# Altium project Projet_ESP32_Nassima_Alexis_Thomas.PrjPcb
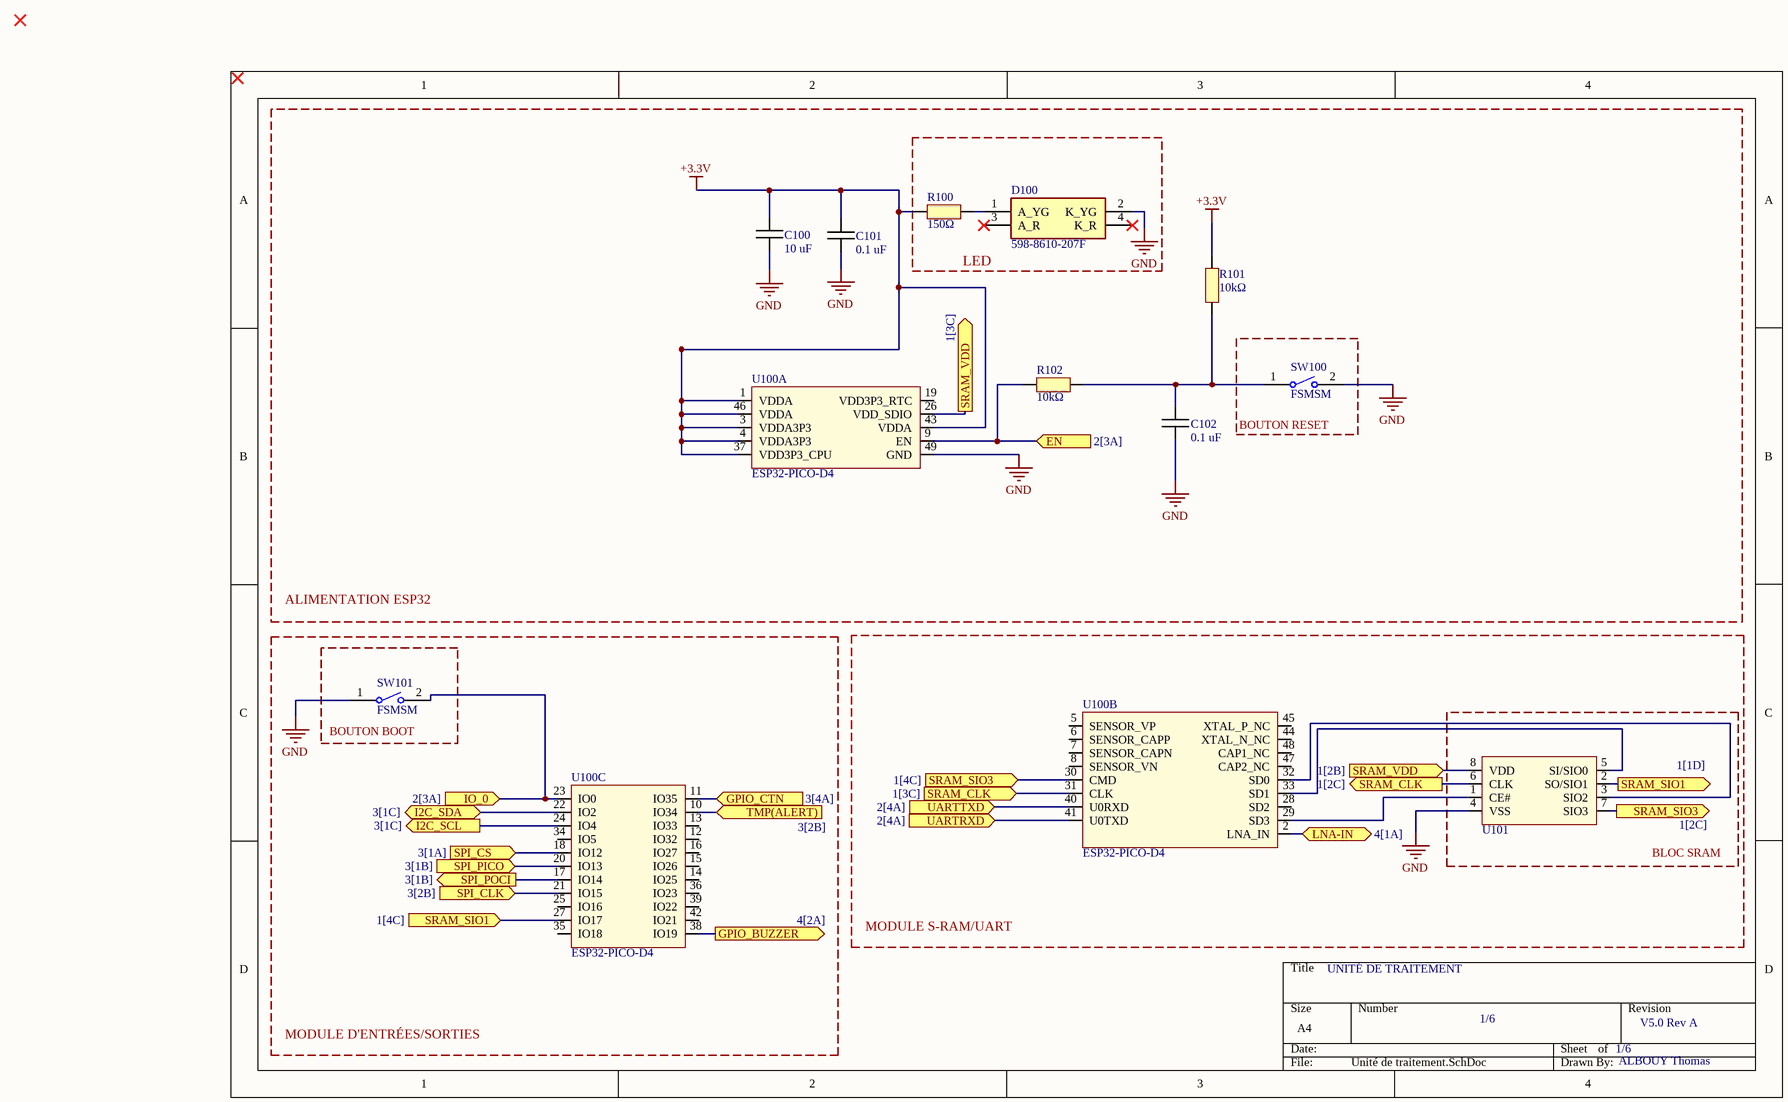
[diagram p0: Unité de traitement.SchDoc]
6 sheets, 72 parts. Net scope: flat (ports and power ports of the same name join across sheets).
Board file: PCB_ESP32_GROUPE5.PcbDoc
Sheets:
  Unité de traitement.SchDoc
  Alimentation.SchDoc
  Mesures.SchDoc
  Accesoire antenne et buzzer.SchDoc
  Connecteurs.SchDoc
  Régulateur USB HT BT.SchDoc

## Sheet Unité de traitement.SchDoc: UNITÉ DE TRAITEMENT
size A4; DrawnBy: ALBOUY Thomas; DocumentNumber: 1/6; Revision: V5.0 Rev A; SheetNumber: 1; SheetTotal: 6

### Parts
C100  10 uF  [CAPC1005X06N]
C101  0.1 uF  [CAPC1005X06N]
C102  0.1 uF  [CAPC1005X06N]
D100  598-8610-207F  [5988610207F]
R100  150Ω  [RESC1005X06N]
R101  10kΩ  [RESC1005X06N]
R102  10kΩ  [RESC1005X06N]
SW100  FSMSM  [TECO-FSMSM-2_V]
SW101  FSMSM  [TECO-FSMSM-2_V]
U100  ESP32-PICO-D4  [PQFN50P700X700X104_HS-49N]  (parts A,B,C of 3)
U101  IS66WVS1M8BLL-104NLI  [SOIC127P600X175-8N]  (value not drawn)

### Blocks framed on the sheet
ALIMENTATION ESP32: C100-C102 R101 R102 U100
LED: D100 R100
BOUTON RESET: SW100
MODULE D'ENTRÉES/SORTIES: U100
MODULE S-RAM/UART: U100
BOUTON BOOT: SW101
BLOC SRAM: U101

### Ports
EN (in, see 2[3A]), GPIO_BUZZER (out, see 4[2A]), GPIO_CTN (in, see 3[4A]), I2C_SCL (out, see 3[1C]), I2C_SDA (bidir, see 3[1C]), IO_0 (in, see 2[3A]), LNA-IN (bidir, see 4[1A]), SPI_CLK (in, see 3[2B]), SPI_CS (in, see 3[1A]), SPI_PICO (in, see 3[1B]), SPI_POCI (out, see 3[1B]), SRAM_CLK (in, see 1[3C]), SRAM_CLK (out, see 1[2C]), SRAM_SIO1 (in, see 1[4C]), SRAM_SIO1 (out, see 1[1D]), SRAM_SIO3 (in, see 1[4C]), SRAM_SIO3 (out, see 1[2C]), SRAM_VDD (in, see 1[2B]), SRAM_VDD (out, see 1[3C]), TMP(ALERT) (in, see 3[2B]), UARTRXD (in, see 2[4A]), UARTTXD (in, see 2[4A])

### Nets
+3.3V: C100.1 C101.1 R100.1 R101.2 U100.1(VDDA) U100.3(VDDA3P3) U100.4(VDDA3P3) U100.37(VDD3P3_CPU) U100.43(VDDA) U100.46(VDDA)
GND: C100.2 C101.2 C102.2 D100.2(K_YG) SW100.2 SW101.1 U100.49(GND) U101.4(VSS)
NetB1_2: U100.11(IO35) ; port GPIO_CTN
NetB*1_1: U100.18(IO12) ; port SPI_CS
NetB*1_3: U100.17(IO14) ; port SPI_POCI
NetB*1_4: U100.21(IO15) ; port SPI_CLK
NetB*1_5: U100.10(IO34) ; port TMP(ALERT)
NetB*2_4: U100.22(IO2) ; port I2C_SDA
NetB*2_5: U100.24(IO4) ; port I2C_SCL
NetC8_1: U100.2(LNA_IN) ; port LNA-IN
NetC102_1: C102.1 R101.1 R102.2 SW100.1
NetD100_1: D100.1(A_YG) R100.2
NetJ3_3: U100.20(IO13) ; port SPI_PICO
NetR12_1: U100.38(IO19) ; port GPIO_BUZZER
NetR102_1: R102.1 U100.9(EN) ; port EN
NetSW101_2: SW101.2 U100.23(IO0) ; port IO_0
NetU100_26: U100.26(VDD_SDIO) U101.8(VDD) ; port SRAM_VDD
NetU100_27: U100.27(IO17) U101.2(SO/SIO1) ; port SRAM_SIO1
NetU100_29: U100.29(SD3) U101.1(CE#)
NetU100_30: U100.30(CMD) U101.7(SIO3) ; port SRAM_SIO3
NetU100_31: U100.31(CLK) U101.6(CLK) ; port SRAM_CLK
NetU100_32: U100.32(SD0) U101.3(SIO2)
NetU100_33: U100.33(SD1) U101.5(SI/SIO0)
NetU100_40: U100.40(U0RXD) ; port UARTTXD
NetU100_41: U100.41(U0TXD) ; port UARTRXD

Not connected (* = marked no-connect by the designer): D100 3(A_R)* 4(K_R)*; U100 5(SENSOR_VP) 6(SENSOR_CAPP) 7(SENSOR_CAPN) 8(SENSOR_VN) 12(IO32) 13(IO33) 14(IO25) 15(IO26) 16(IO27) 19(VDD3P3_RTC) 25(IO16) 28(SD2) 34(IO5) 35(IO18) 36(IO23) 39(IO22) 42(IO21) 44(XTAL_N_NC) 45(XTAL_P_NC) 47(CAP2_NC) 48(CAP1_NC)

### Library data of the parts
C100-C102 = Capacitor
D100 = 598-8610-207F: Standard LEDs - SMD Red/Green WC 80/50mcd 645/570nm; Manufacturer_Name: Dialight; Geometry.Height: 0.8mm; Manufacturer_Part_Number: 598-8610-207F; Mouser Part Number: 645-598-8610-207F; Mouser Price/Stock: https://www.mouser.co.uk/ProductDetail/Dialight/598-8610-207F?qs=7JStj%2FjQ2SFuCjosqwklHQ%3D%3D; Arrow Part Number: 598-8610-207F; Arrow Price/Stock: https://www.arrow.com/en/products/598-8610-207f/dialight?region=nac; Datasheet Link: https://media.digikey.com/pdf/Data%20Sheets/Dialight%20PDFs/598%20Series%201210%20Pkg%20Bi-Color.pdf
R100-R102 = Resistor
SW100 SW101 = CMP-2000-07511-1: FSMSM Push Button Switch, 50 mA, -35 to 85 degC, 2-Pin SMD, RoHS, Bulk; Manufacturer: TE Connectivity; Actuator Length: 1.07mm; Electrical Life: 20000Cycles; Actuator Material: Polyamide; Current Rating: 50mA; Illumination Type: Illuminated; Voltage Rating (DC): 24V; Contact Resistance: 100mOhm; Case\/Package: SMD/SMT; Operating Force: 180gf; Switch Travel: 0.25mm; Max Voltage Rating (DC): 12V; Throw Configuration: SPST; Packaging: LoosePiece; Max Operating Temperature: 85degC; ELV: Compliant; Package Description: 2-Pin Surface Mount Device, Body 6 x 3.5 mm, Pitch 9.19 mm; RoHSCompliant: true; Manufacturer URL: http://www.te.com/; Contact Plating: Silver; Contact Material: Brass; Mounting Technology: SurfaceMount; Contact Current Rating: 50mA; Datasheet Version: Rev. C2, 08/2014; Datasheet URL: http://www.te.com/commerce/DocumentDelivery/DDEController?Action=showdoc&DocId=Customer+Drawing%7F1437566-3%7FC2%7Fpdf%7FEnglish%7FENG_CD_1437566-3_C2_1437566_3_1_c.dwg.pdf%7F1437566-3; Mechanical Life: 20000Cycles; Package Reference: FSMSM; REACH SVHC: Unknown; Orientation: Straight; Min Operating Temperature: -35degC; Lead Free: LeadFree; Termination: GullWing; Package Quantity: 1000; Mount: SurfaceMount
U100 = ESP32: Système RF sur puce - SoC SIP module ESP32 with 4MByte Flash, Dual Core MCU, Wi-Fi & Bluetooth Combo, LGA48-pin, 7*7mm; Manufacturer 1: Espressif Systems; Supplier 1: Digi-Key; Supplier Part Number 1: 1904-1029-1-ND; Manufacturer Part Number 1: ESP32-PICO-D4
U101 = SRAM: SRAM 8Mb, SerialRAM, 2.7V-3.6V, 104MHz, 8 pin SOIC 150 mil, RoHS; Manufacturer 1: ISSI; Supplier 1: Digi-Key; Supplier Part Number 1: 706-IS66WVS1M8BLL-104NLI-ND; Manufactuer Part Number 1: IS66WVS1M8BLL-104NLI

## Sheet Alimentation.SchDoc
size A4; SheetNumber: 4; SheetTotal: 7
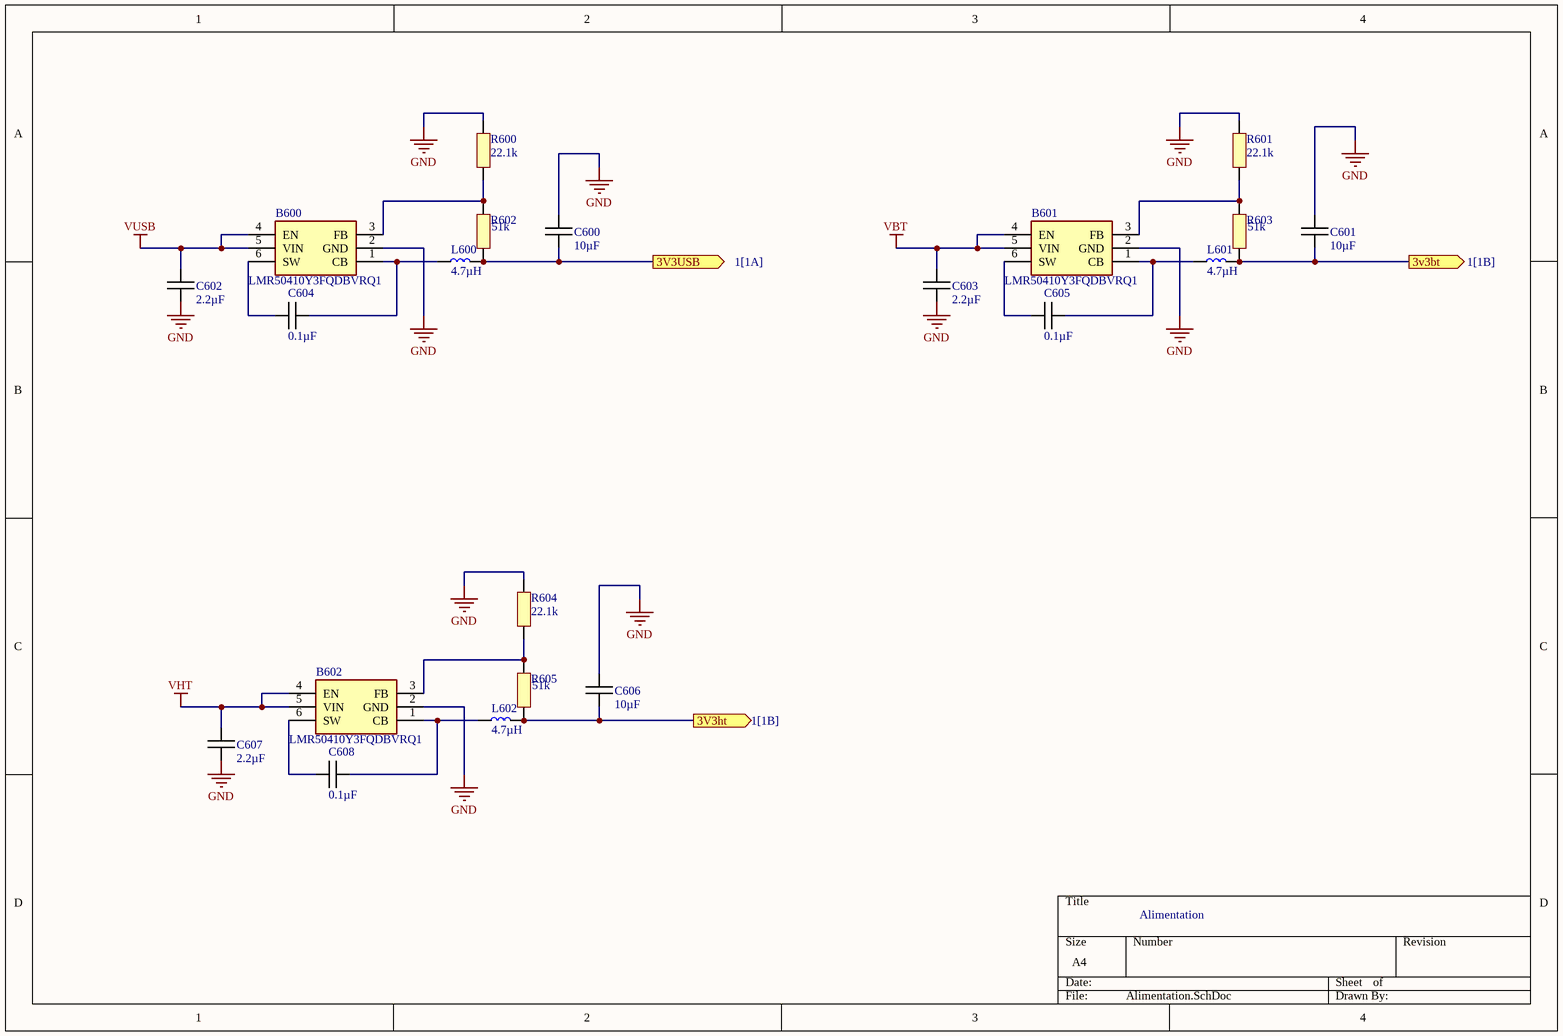
[diagram p1: Alimentation.SchDoc]

### Parts
B600  LMR50410Y3FQDBVRQ1  [SOT95P280X145-6N]
B601  LMR50410Y3FQDBVRQ1  [SOT95P280X145-6N]
B602  LMR50410Y3FQDBVRQ1  [SOT95P280X145-6N]
C600  10µF  [CAPC1005X06N]
C601  10µF  [CAPC1005X06N]
C602  2.2µF  [CAPC1005X06N]
C603  2.2µF  [CAPC1005X06N]
C604  0.1µF  [CAPC1005X06N]
C605  0.1µF  [CAPC1005X06N]
C606  10µF  [CAPC1005X06N]
C607  2.2µF  [CAPC1005X06N]
C608  0.1µF  [CAPC1005X06N]
L600  4.7µH  [LQPC1005X06N]
L601  4.7µH  [LQPC1005X06N]
L602  4.7µH  [LQPC1005X06N]
R600  22.1k  [RESC1005X06N]
R601  22.1k  [RESC1005X06N]
R602  51k  [RESC1005X06N]
R603  51k  [RESC1005X06N]
R604  22.1k  [RESC1005X06N]
R605  51k  [RESC1005X06N]

### Ports
3v3bt (out, see 1[1B]), 3V3ht (out, see 1[1B]), 3V3USB (out, see 1[1A])

### Nets
GND: B600.2(GND) B601.2(GND) B602.2(GND) C600.1 C601.1 C602.2 C603.2 C606.1 C607.2 R600.2 R601.2 R604.2
VBT: B601.4(EN) B601.5(VIN) C603.1
VHT: B602.4(EN) B602.5(VIN) C607.1
VUSB: B600.4(EN) B600.5(VIN) C602.1
NetB600_1: B600.1(CB) C604.1 L600.1
NetB600_3: B600.3(FB) R600.1 R602.2
NetB600_6: B600.6(SW) C604.2
NetB601_1: B601.1(CB) C605.1 L601.1
NetB601_3: B601.3(FB) R601.1 R603.2
NetB601_6: B601.6(SW) C605.2
NetB602_1: B602.1(CB) C608.1 L602.1
NetB602_3: B602.3(FB) R604.1 R605.2
NetB602_6: B602.6(SW) C608.2
NetC600_2: C600.2 L600.2 R602.1 ; port 3V3USB
NetC601_2: C601.2 L601.2 R603.1 ; port 3v3bt
NetC606_2: C606.2 L602.2 R605.1 ; port 3V3ht

### Notes on the sheet
- Alimentation

### Library data of the parts
B600-B602 = LMR50410Y3FQDBVRQ1: Régulateurs de tension de commutation Automotive qualified SIMPLE SWITCHER 4-V to 36-V, 1-A synchronous step-down converter 6-SOT-23 -40 to 150; Manufacturer_Name: Texas Instruments; Manufacturer_Part_Number: LMR50410Y3FQDBVRQ1; Mouser Part Number: 595-R50410Y3FQDBVRQ1
C600-C608 = Capacitor
L600-L602 = Bobine
R600-R605 = Resistor

## Sheet Mesures.SchDoc: MESURES CAPTEUR TEMPÉRATURE
size A4; DrawnBy: ALBOUY Thomas; DocumentNumber: 3/6; Revision: V5.0 REV.A; SheetNumber: 3; SheetTotal: 6
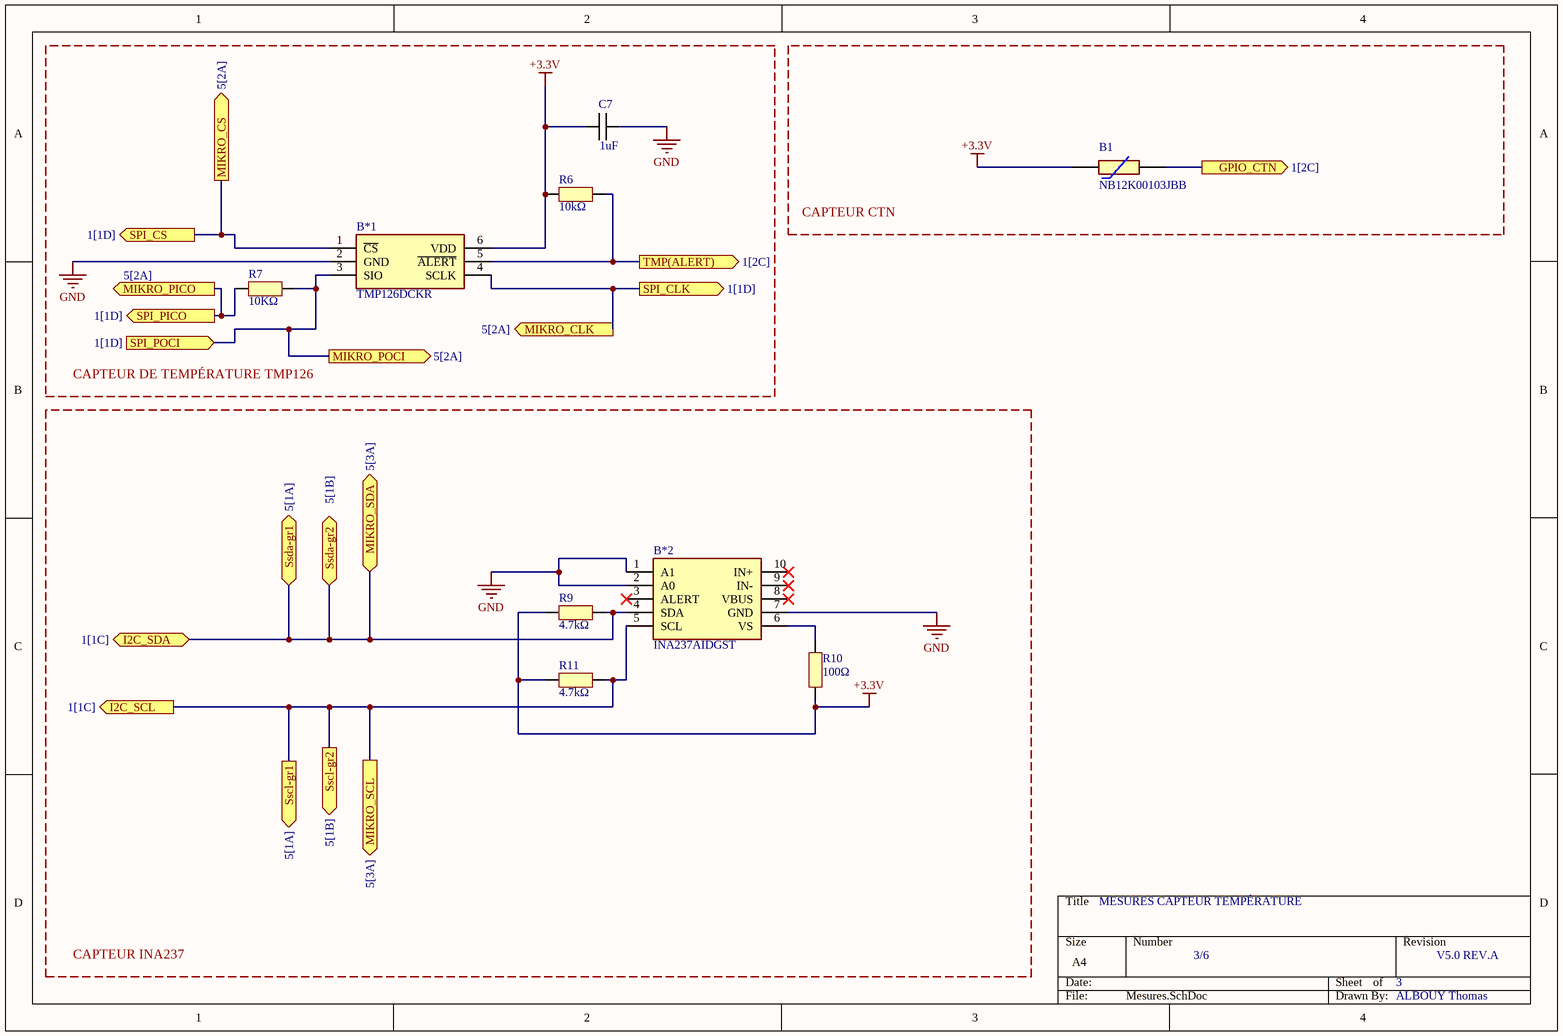
[diagram p2: Mesures.SchDoc]

### Parts
B1  NB12K00103JBB  [RESC2212X50N]
B*1  TMP126DCKR  [SOT65P210X110-6N]
B*2  INA237AIDGST  [SOP50P490X110-10N]
C7  1uF  [CAPC1005X06N]
R6  10kΩ  [RESC1005X06N]
R7  10KΩ  [RESC1005X06N]
R9  4.7kΩ  [RESC1005X06N]
R10  100Ω  [RESC1005X06N]
R11  4.7kΩ  [RESC1005X06N]

### Blocks framed on the sheet
CAPTEUR DE TEMPÉRATURE TMP126: B*1 C7 R6 R7
CAPTEUR CTN: B1
CAPTEUR INA237: B*2 R9-R11

### Ports
GPIO_CTN (out, see 1[2C]), I2C_SCL (out, see 1[1C]), I2C_SDA (bidir, see 1[1C]), MIKRO_CLK (out, see 5[2A]), MIKRO_CS (out, see 5[2A]), MIKRO_PICO (out, see 5[2A]), MIKRO_POCI (out, see 5[2A]), MIKRO_SCL (out, see 5[3A]), MIKRO_SDA (bidir, see 5[3A]), SPI_CLK (out, see 1[1D]), SPI_CS (out, see 1[1D]), SPI_PICO (out, see 1[1D]), SPI_POCI (in, see 1[1D]), Sscl-gr1 (out, see 5[1A]), Sscl-gr2 (out, see 5[1B]), Ssda-gr1 (bidir, see 5[1A]), Ssda-gr2 (bidir, see 5[1B]), TMP(ALERT) (out, see 1[2C])

### Nets
+3.3V: B1.1 B*1.6(VDD) C7.1 R6.1 R9.1 R10.1 R11.1
GND: B*1.2(GND) B*2.1(A1) B*2.2(A0) B*2.7(GND) C7.2
NetB1_2: B1.2 ; port GPIO_CTN
NetB*1_1: B*1.1(~{CS}) ; port SPI_CS, port MIKRO_CS
NetB*1_3: B*1.3(SIO) R7.2 ; port SPI_POCI, port MIKRO_POCI
NetB*1_4: B*1.4(SCLK) ; port SPI_CLK, port MIKRO_CLK
NetB*1_5: B*1.5(~{ALERT}) R6.2 ; port TMP(ALERT)
NetB*2_4: B*2.4(SDA) R9.2 ; port I2C_SDA, port Ssda-gr1, port Ssda-gr2, port MIKRO_SDA
NetB*2_5: B*2.5(SCL) R11.2 ; port I2C_SCL, port Sscl-gr1, port Sscl-gr2, port MIKRO_SCL
NetB*2_6: B*2.6(VS) R10.2
NetJ3_3: R7.1 ; port SPI_PICO, port MIKRO_PICO

Not connected (* = marked no-connect by the designer): B*2 3(ALERT)* 8(VBUS)* 9(IN-)* 10(IN+)*

### Notes on the sheet
- 3

### Library data of the parts
B1 = NB12K00103JBB: NTC SMD Thermistor, NB12K, 10K, 5% AVX 10k 0805 Protection NTC Thermistor, 5s, 2 x 1.25 x 1.3mm; Manufacturer_Name: Kyocera AVX; Geometry.Height: 0.5mm; Manufacturer_Part_Number: NB12K00103JBB; Mouser Part Number: 581-NB12K00103JBB; Mouser Price/Stock: https://www.mouser.co.uk/ProductDetail/AVX/NB12K00103JBB/?qs=4%252B6%252BTdINQeDPvI%252BQUQjJ3Q%3D%3D; Arrow Part Number: NB12K00103JBB; Arrow Price/Stock: https://www.arrow.com/en/products/nb12k00103jbb/avx; Datasheet Link: https://datasheet.datasheetarchive.com/originals/distributors/Datasheets-DGA6/551314.pdf
B*1 = TMP126DCKR: Board Mount Temperature Sensors +/-0.25 C SPI temperature sensor with 175 C operation, CRC and slew-rate alert; Manufacturer_Name: Texas Instruments; Manufacturer_Part_Number: TMP126DCKR; Mouser Part Number: 595-TMP126DCKR
B*2 = INA237AIDGST: Current Sense Amplifiers 85-V, 16-bit, I2C output current/voltage/power monitor with alert 10-VSSOP -40 to 125; Manufacturer_Name: Texas Instruments; Manufacturer_Part_Number: INA237AIDGST; Mouser Part Number: 595-INA237AIDGST
C7 = Capacitor
R6 R7 R9-R11 = Resistor

## Sheet Accesoire antenne et buzzer.SchDoc: ANTENNE BLUETOOTH/BUZZER
size A4; DrawnBy: TORIBIO Alexis; Address4: 4; DocumentNumber: 4/6; Revision: V5.0 REV.A; SheetNumber: 4; SheetTotal: 6
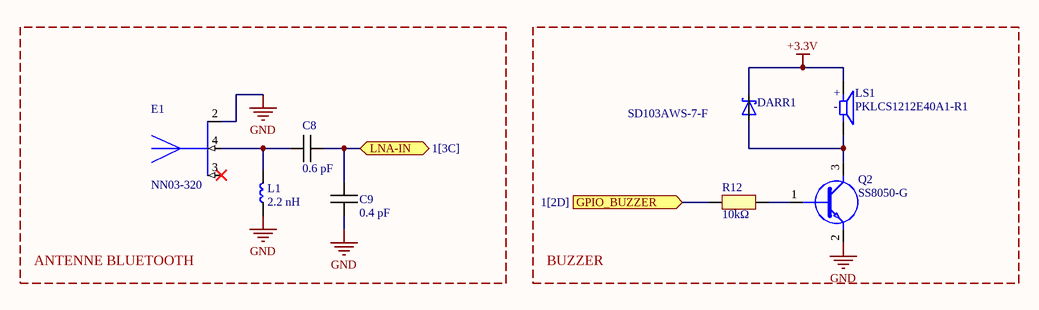
[diagram p3: Accesoire antenne et buzzer.SchDoc]

### Parts
C8  0.6 pF  [CAPC1005X06N]
C9  0.4 pF  [CAPC1005X06N]
DARR1  SD103AWS-7-F  [SD103AWS-7-F]
E1  NN03-320  [XCVR_NN03-320]
L1  2.2 nH  [LQPC1005X06N]
LS1  PKLCS1212E40A1-R1  [SPKR_PKLCS1212E40A1-R1]
Q2  SS8050-G  [SS8050-G]
R12  10kΩ  [RESC1005X06N]

### Blocks framed on the sheet
ANTENNE BLUETOOTH: C8 C9 E1 L1
BUZZER: DARR1 LS1 Q2 R12

### Ports
GPIO_BUZZER (in, see 1[2D]), LNA-IN (bidir, see 1[3C])

### Nets
+3.3V: DARR1.1(C) LS1.P
GND: C9.2 E1.2(GROUND) L1.1 Q2.2(E)
NetC8_1: C8.1 C9.1 ; port LNA-IN
NetC8_2: C8.2 E1.4(FEED_GNSS) L1.2
NetDARR1_2: DARR1.2(A) LS1.N Q2.3(C)
NetQ2_1: Q2.1(B) R12.2
NetR12_1: R12.1 ; port GPIO_BUZZER

Not connected (* = marked no-connect by the designer): E1 3(FEED_BLUETOOTH)*

### Notes on the sheet
- (in symbol PKLCS1212E40A1-R1) +; -

### Library data of the parts
C8 C9 = Capacitor
DARR1 = SD103AWS-7-F: Diode Array 3 Independent Schottky 40V 175mA Surface Mount 6-TSSOP, SC-88, SOT-363
E1 = NN03-320: Dual port antenna booster for GNSS, Bluetooth, 5G and UWB (1561 - 1606MHz, 2400 - 2500MHz, 3400 - 3800MHz, 3100 - 4800MHz and 6000 - 10600 MHz), signal booster; Manufacturer_Name: Ignion; Manufacturer_Part_Number: NN03-320; Mouser Part Number: 128-NN03-320
L1 = Bobine
LS1 = PKLCS1212E40A1-R1: Buzzers Transducer, Externally Driven Piezo 1.5V 2kHz 70dB @ 1.5V, 10cm Surface Mount Solder Pads; MF: Murata Electronics; Value: *; MP: PKLCS1212E40A1-R1; Package: None; Availability: Unavailable; Price: None
Q2 = SS8050-G: Bipolar Transistors - BJT NPN TRANSISTOR 1.5A 40V
R12 = Resistor

## Sheet Connecteurs.SchDoc: CONNECTEURS GROVE ET MIKROBUS
size A4; DrawnBy: TORIBIO ALEXIS  ALBOUY THOMAS; Address4: 5; DocumentNumber: 5/6; Revision: V5.0 REV.A; SheetNumber: 5; SheetTotal: 6
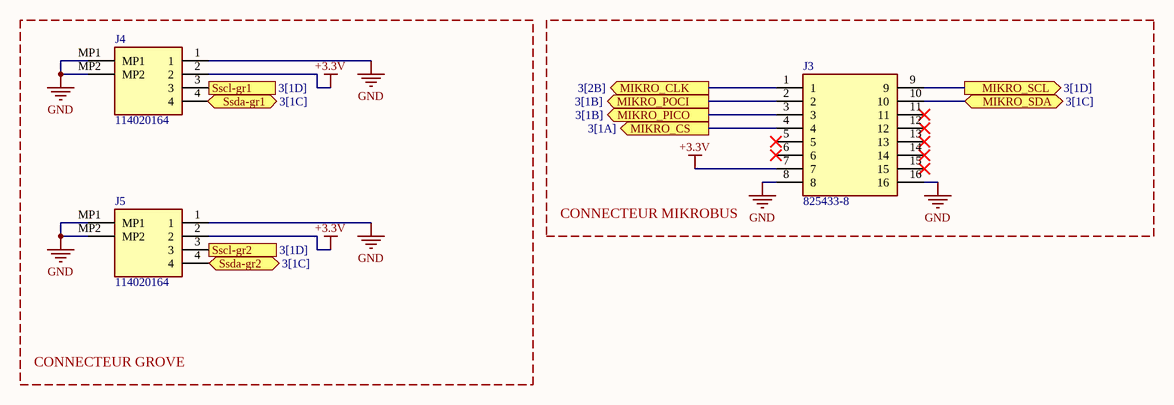
[diagram p4: Connecteurs.SchDoc]

### Parts
J3  825433-8
J4  114020164  [114020164]
J5  114020164  [114020164]

### Blocks framed on the sheet
CONNECTEUR GROVE: J4 J5
CONNECTEUR MIKROBUS: J3

### Ports
MIKRO_CLK (out, see 3[2B]), MIKRO_CS (out, see 3[1A]), MIKRO_PICO (out, see 3[1B]), MIKRO_POCI (out, see 3[1B]), MIKRO_SCL (out, see 3[1D]), MIKRO_SDA (bidir, see 3[1C]), Sscl-gr1 (out, see 3[1D]), Sscl-gr2 (in, see 3[1D]), Ssda-gr1 (bidir, see 3[1C]), Ssda-gr2 (bidir, see 3[1C])

### Nets
+3.3V: J3.7 J4.2 J5.2
GND: J3.8 J3.16 J4.1 J4.MP1 J4.MP2 J5.1 J5.MP1 J5.MP2
NetB*1_1: J3.4 ; port MIKRO_CS
NetB*1_3: J3.2 ; port MIKRO_POCI
NetB*1_4: J3.1 ; port MIKRO_CLK
NetB*2_4: J3.10 J5.4 ; port Ssda-gr1, port Ssda-gr2, port MIKRO_SDA
NetB*2_5: J3.9 J4.3 J5.3 ; port Sscl-gr1, port Sscl-gr2, port MIKRO_SCL
NetJ3_3: J3.3 ; port MIKRO_PICO

Not connected (* = marked no-connect by the designer): J3 5* 6* 11* 12* 13* 14* 15*; J4 4

### Library data of the parts
J3 = Connect-Mikronus: Headers & Wire Housings 8P double for connection mikrobus; Manufacturer_Name: TE Connectivity; Manufacturer_Part_Number: 825433-8; Mouser Part Number: 571-825433-8
J4 J5 = 114020164: Seeed Studio Accessories Grove Female Header - SMD-4P-2.0mm-90D-20Pcs; Manufacturer_Name: Seeed Studio; Manufacturer_Part_Number: 114020164; Mouser Part Number: 713-114020164

## Sheet Régulateur USB HT BT.SchDoc: RÉGULATEUR DE TENSION USB-C HT BT
size A4; DrawnBy: ELOTMANI Nassima; Address4: 6; DocumentNumber: 6/6; Revision: V5.0 REV.A; SheetNumber: 6; SheetTotal: 6
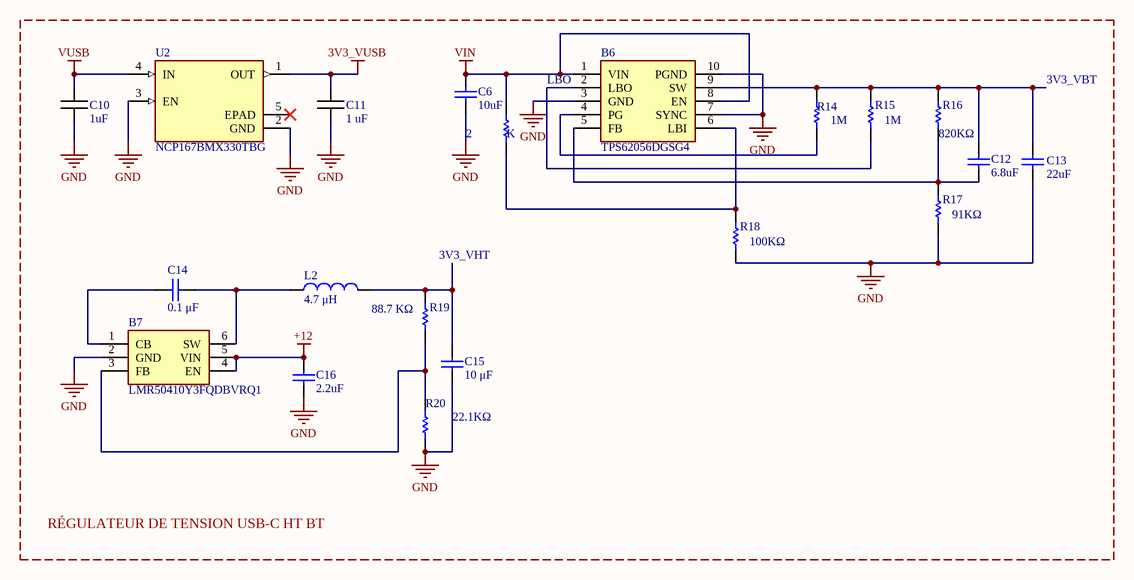
[diagram p5: Régulateur USB HT BT.SchDoc]

### Parts
2  value K  (hidden comment: R6)
B6  TPS62056DGSG4  [SOP50P490X110-10N]
B7  LMR50410Y3FQDBVRQ1  [SOT95P280X145-6N]
C6  value 10uF  (hidden comment: Comment)
C10  1uF  [CAPC1005X06N]
C11  1 uF  [CAPC1005X06N]
C12  value 6.8uF  (hidden comment: Comment)
C13  value 22uF  (hidden comment: Comment)
C14  value 0.1 μF  (hidden comment: Comment)
C15  value 10 μF  (hidden comment: Comment)
C16  value 2.2uF  (hidden comment: Comment)
L2  value 4.7 μH  (hidden comment: Comment)
R14  value 1M  (hidden comment: Comment)
R15  value 1M  (hidden comment: Comment)
R16  value 820KΩ  (hidden comment: Comment)
R17  value 91KΩ  (hidden comment: Comment)
R18  value 100KΩ  (hidden comment: Comment)
R19  value 88.7 KΩ  (hidden comment: Comment)
R20  value 22.1KΩ  (hidden comment: Comment)
U2  NCP167BMX330TBG  [NCP167BMX330TBG]

### Nets
3V3_VUSB: C11.2 U2.1(OUT)
+12: B7.4(EN) B7.5(VIN) C16.1
GND: B6.3(GND) B6.7(SYNC) B6.10(PGND) B7.2(GND) C6.2 C10.1 C11.1 C13.2 C15.2 C16.2 R17.1 R18.2 R20.2 U2.2(GND) U2.3(EN)
VIN: 2.2 B6.1(VIN) B6.8(EN) C6.1
VUSB: C10.2 U2.4(IN)
Net2_1: 2.1 B6.6(LBI) R18.1
NetB6_2: B6.2(LBO) R15.2
NetB6_4: B6.4(PG) R14.2
NetB6_5: B6.5(FB) C12.2 R16.2 R17.2
NetB6_9: B6.9(SW) C12.2 C13.2 R14.2 R15.2 R16.2
NetB7_1: B7.1(CB) C14.1
NetB7_3: B7.3(FB) R19.2 R20.1
NetB7_6: B7.6(SW) C14.2 L2.1
NetC15_2: C15.2 L2.2 R19.2

Not connected (* = marked no-connect by the designer): U2 5(EPAD)*

### Notes on the sheet
- LBO
- 3V3_VBT
- (near R19) 3V3_VHT
- RÉGULATEUR DE TENSION USB-C HT BT

### Library data of the parts
2 R14-R20 = Resistor: TC1: 0; SimulationGenericComponent: True; TC2: 0
B6 = TPS62056DGSG4: TEXAS INSTRUMENTS - TPS62056DGSG4 - Synchronous Buck (Step Down) Switching Regulator, Fixed, 2.7V-10Vin, 3.3V/0.8A out, 850kHz, VSSOP-10; Manufacturer_Name: Texas Instruments; Manufacturer_Part_Number: TPS62056DGSG4; Mouser Part Number: 595-TPS62056DGSG4
B7 = LMR50410Y3FQDBVRQ1: as B600 on sheet Alimentation; Manufacturer_Part_Number: LMR50410Y3FQDBVRQ1; Mouser Part Number: 595-R50410Y3FQDBVRQ1
C6 C12-C16 = Capacitor: SimulationGenericComponent: True
C10 C11 = Capacitor
L2 = Inductor: SimulationGenericComponent: True
U2 = NCP167BMX330TBG: Régulateurs de tension LDO LDO 700 MA ULTRA-LOW NOISE 3.3V

## Nets that join several sheets
+3.3V: Unité de traitement (10 pins), Mesures (7 pins), Accesoire antenne et buzzer (DARR1.1 LS1.P), Connecteurs (J3.7 J4.2 J5.2)
GND: Unité de traitement (8 pins), Alimentation (12 pins), Mesures (5 pins), Accesoire antenne et buzzer (C9.2 E1.2 L1.1 Q2.2), Connecteurs (8 pins), Régulateur USB HT BT (15 pins)
VUSB: Alimentation (B600.4 B600.5 C602.1), Régulateur USB HT BT (C10.2 U2.4)
NetB1_2: Unité de traitement (U100.11), Mesures (B1.2)
NetB*1_1: Unité de traitement (U100.18), Mesures (B*1.1), Connecteurs (J3.4)
NetB*1_3: Unité de traitement (U100.17), Mesures (B*1.3 R7.2), Connecteurs (J3.2)
NetB*1_4: Unité de traitement (U100.21), Mesures (B*1.4), Connecteurs (J3.1)
NetB*1_5: Unité de traitement (U100.10), Mesures (B*1.5 R6.2)
NetB*2_4: Unité de traitement (U100.22), Mesures (B*2.4 R9.2), Connecteurs (J3.10 J5.4)
NetB*2_5: Unité de traitement (U100.24), Mesures (B*2.5 R11.2), Connecteurs (J3.9 J4.3 J5.3)
NetC8_1: Unité de traitement (U100.2), Accesoire antenne et buzzer (C8.1 C9.1)
NetJ3_3: Unité de traitement (U100.20), Mesures (R7.1), Connecteurs (J3.3)
NetR12_1: Unité de traitement (U100.38), Accesoire antenne et buzzer (R12.1)